# EAGLE design 4_serial_LSA (EAGLE 9.2.0)
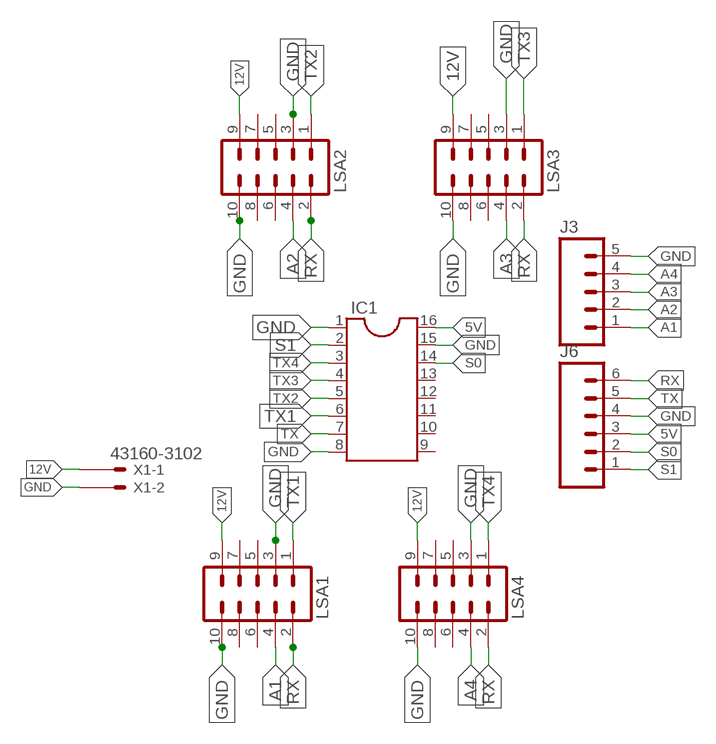
[diagram p0: schematic, sheet 1]

## Parts
IC1  DIL16S  [SOCKET-16]
J3  M05PTH  [1X05]
J6  M06SILK_FEMALE_PTH  [1X06]
LSA1  M05X2SHD_LOCK  [2X5-SHROUDED_LOCK]
LSA2  M05X2SHD_LOCK  [2X5-SHROUDED_LOCK]
LSA3  M05X2SHD_LOCK  [2X5-SHROUDED_LOCK]
LSA4  M05X2SHD_LOCK  [2X5-SHROUDED_LOCK]
X1  43160-3102  [43160-XX02]

## Nets
5V: IC1.16 J6.3
12V: LSA1.9 LSA2.9 LSA3.9 LSA4.9 X1.1@1(-1:S)
A1: J3.1 LSA1.4
A2: J3.2 LSA2.4
A3: J3.3 LSA3.4
A4: J3.4 LSA4.4
GND: IC1.1 IC1.8 IC1.15 J3.5 J6.4 LSA1.3 LSA1.10 LSA2.3 LSA2.10 LSA3.3 LSA3.10 LSA4.3 LSA4.10 X1.2@1(-2:S)
RX: J6.6 LSA1.2 LSA2.2 LSA3.2 LSA4.2
S0: IC1.14 J6.2
S1: IC1.2 J6.1
TX: IC1.7 J6.5
TX1: IC1.6 LSA1.1
TX2: IC1.5 LSA2.1
TX3: IC1.4 LSA3.1
TX4: IC1.3 LSA4.1
Unconnected: IC1.9 IC1.10 IC1.11 IC1.12 IC1.13 LSA1.5 LSA1.6 LSA1.7 LSA1.8 LSA2.5 LSA2.6 LSA2.7 LSA2.8 LSA3.5 LSA3.6 LSA3.7 LSA3.8 LSA4.5 LSA4.6 LSA4.7 LSA4.8 X1.1@2(-1:S) X1.2@2(-2:S)

## Library data of the parts
IC1 = ic-package:DIL16: Dual In Line / Socket
J3 = SparkFun-Connectors:M05: Header 5 Standard 5-pin 0.1" header. Use with straight break away headers (SKU : PRT-00116), right angle break away headers (PRT-00553), swiss pins (PRT-00743), machine pins (PRT-00117), and female headers (PRT-00115). Molex polarized connector foot print use with SKU : PRT-08230 with associated crimp pins and housings.; SPICEPREFIX: X
J6 = SparkFun-Connectors:M06: Header 6 Standard 6-pin 0.1" header. Use with straight break away headers (SKU : PRT-00116), right angle break away headers (PRT-00553), swiss pins (PRT-00743), machine pins (PRT-00117), and female headers (PRT-00115). Molex polarized connector foot print use with SKU : PRT-08094 with associated crimp pins and housings. NOTES ON THE VARIANTS LOCK and LOCK_LONGPADS... This footprint was designed to help hold the alignment of a through-hole component (i.e. 6-pin header) while soldering it into place. You may notice that each hole has been shifted either up or down by 0.005 of an inch from it's more standard position (which is a perfectly straight line). This slight alteration caused the pins (the squares in the middle) to touch the edges of the holes. Because they are alternating, it causes a "brace" to hold the component in place. 0.005 has proven to be the perfect amount of "off-center" position when using our standard breakaway headers. Although looks a little odd when you look at the bare footprint, once you have a header in there, the alteration is very hard to notice. Also,if you push a header all the way into place, it is covered up entirely on the bottom side. This idea of altering the position of holes to aid alignment will be further integrated into the Sparkfun Library for other footprints. It can help hold any component with 3 or more connection pins.; PROD_ID: CONN-08437
LSA1-LSA4 = SparkFun-Connectors:M05X2: Header 5x2 Standard 10-pin dual row 0.1" header. Commonly used with AVR-ISP. Use with Spark Fun Electronics SKU: PRT-00778
X1 = con-molex:43160-*02: SDA-43160 Connector Source: http://www.molex.com/pdm_docs/sd/431601306_sd.pdf; MF: WALDOM/MOLEX; MPN: 43160-3102; OC_FARNELL: 3293038; OC_NEWARK: 54H0264

## Net classes
0 default: width 0.305 mm, drill 0.508 mm, clearance 0.305 mm

## Board
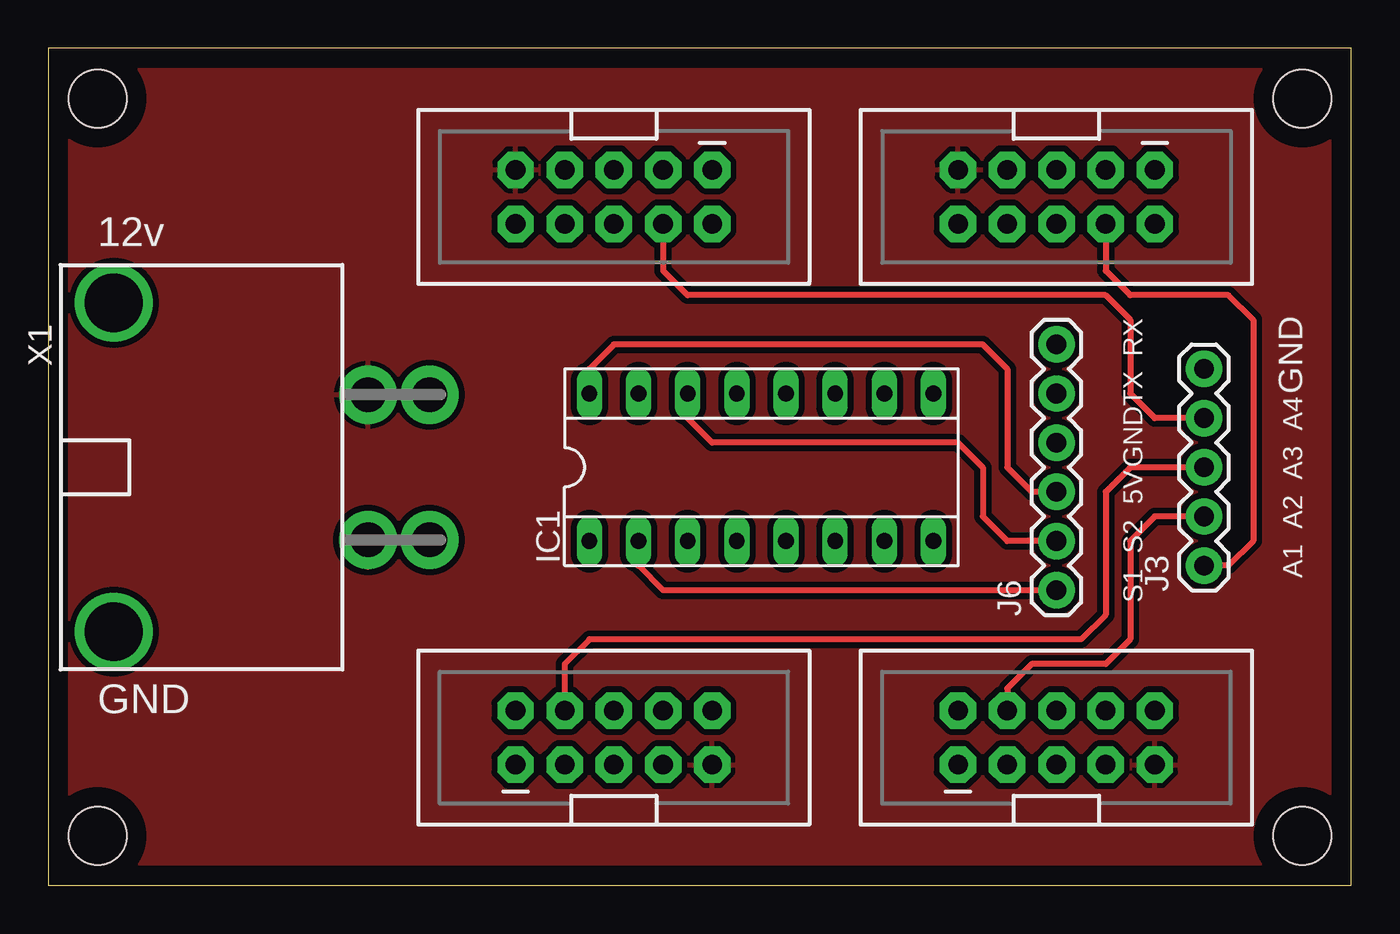
[diagram p1: board, top side]
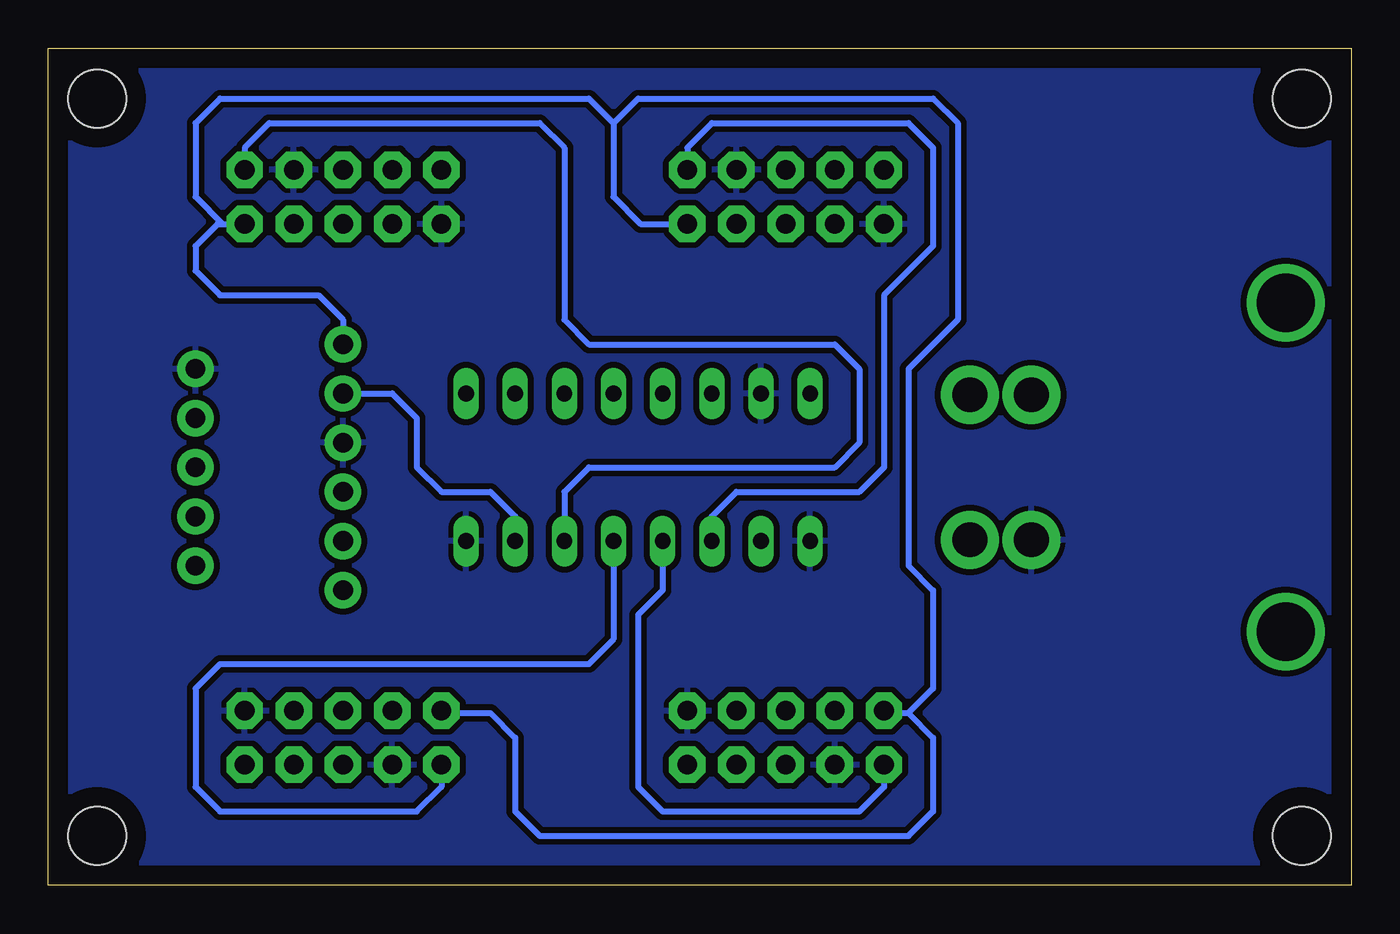
[diagram p2: board, bottom side, seen from below]

Size 67.29 x 43.23 mm. Coordinates in mm from the lower left corner, seen from the top.
Outline: 0,0 67.29,0 67.29,43.23 0,43.23 0,0
Copper layers (1*16): Top 0.035mm / dielectric 1.5mm / Bottom 0.035mm
Design rules "default": minimum track width 6mil, minimum drill 0.35mm, track to track 6mil, track to pad 6mil, pad to pad 6mil, via to via 6mil, smd to smd 6mil, copper to edge 40mil, drill to drill 6mil, minimum pad ring 10mil, minimum via ring 8mil, stop-mask expansion 4mil, vias tented up to drill 0mil, thermal gap 10mil
Holes 3 mm at 2.54,40.64 2.54,2.54 64.77,2.54 64.77,40.64

### Footprints (pad centres in the part's own frame; a part is rotated, then mirrored left to right if it is on the bottom)
SOCKET-16 = drill 0.813 long: 1 -8.89,-3.81; 2 -6.35,-3.81; 3 -3.81,-3.81; 4 -1.27,-3.81; 5 1.27,-3.81; 6 3.81,-3.81; 7 6.35,-3.81; 8 8.89,-3.81; 9 8.89,3.81; 10 6.35,3.81; 11 3.81,3.81; 12 1.27,3.81; 13 -1.27,3.81; 14 -3.81,3.81; 15 -6.35,3.81; 16 -8.89,3.81
1X05 = drill 1.016 pad 1.88: 1 0,0; 2 2.54,0; 3 5.08,0; 4 7.62,0; 5 10.16,0
1X06 = drill 1.016 pad 1.88: 1 0,0; 2 2.54,0; 3 5.08,0; 4 7.62,0; 5 10.16,0; 6 12.7,0
2X5-SHROUDED_LOCK = drill 1.016 pad 1.88 octagon: 1 -1.397,5.08; 2 1.397,5.08; 3 -1.397,2.54; 4 1.397,2.54; 5 -1.397,0; 6 1.397,0; 7 -1.397,-2.54; 8 1.397,-2.54; 9 -1.397,-5.08; 10 1.397,-5.08
43160-XX02 = drill 1.8 pad 3: 1@1 -3.745,0; 1@2 -3.745,3.18; 2@1 3.745,0; 2@2 3.745,3.18 | drill 3 pad 3.4: M1 -8.495,-13.13; M2 8.495,-13.13

### Placement (x,y rotation side)
IC1  36.83,21.59 0 top
J3  59.69,16.51 90 top
J6  52.07,15.24 90 top
LSA1  52.07,35.56 270 top
LSA2  52.07,7.62 90 top
LSA3  29.21,7.62 90 top
LSA4  29.21,35.56 270 top
X1  16.51,21.59 270 top

### Tracks (layer width: path | path; a pad name or v marks a point on that pad's centre or on a via)
5V
  Top 0.305: J6.3 50.8,20.32 49.53,21.59 49.53,26.67 48.26,27.94 29.21,27.94 27.94,26.67 IC1.16
12V
  pour Top (isolate 0.305): -1.27,44.45 -1.27,-1.27 68.58,-1.27 68.58,44.45
A1
  Top 0.305: J3.1 60.96,16.51 62.23,17.78 62.23,29.21 60.96,30.48 55.88,30.48 54.61,31.75 LSA1.4
A2
  Top 0.305: J3.2 57.15,19.05 55.88,17.78 55.88,12.7 54.61,11.43 50.8,11.43 49.53,10.16 LSA2.4
A3
  Top 0.305: J3.3 55.88,21.59 54.61,20.32 54.61,13.97 53.34,12.7 27.94,12.7 26.67,11.43 LSA3.4
A4
  Top 0.305: LSA4.4 31.75,31.75 33.02,30.48 54.61,30.48 55.88,29.21 55.88,25.4 57.15,24.13 J3.4
GND
  Top 0.406: 16.51,16.51 X1.2@1
  pour Bottom (isolate 0.305): -1.27,44.45 -1.27,-1.27 68.58,-1.27 68.58,44.45
RX
  Bottom 0.305: LSA4.2 36.7,34.16 38.1,35.56 38.1,39.37 | 38.1,39.37 39.37,40.64 58.42,40.64 59.69,39.37 59.69,35.56 58.29,34.16 | 58.29,34.16 LSA1.2 | LSA2.2 46.86,8.89 44.45,8.89 43.18,7.62 43.18,3.81 41.91,2.54 22.86,2.54 21.59,3.81 21.59,7.62 22.86,8.89 | 22.86,8.89 24,8.89 LSA3.2 | 58.29,34.16 58.55,34.16 59.69,33.02 59.69,31.75 58.42,30.48 53.34,30.48 52.07,29.21 J6.6 | 38.1,39.37 36.83,40.64 21.59,40.64 20.32,39.37 20.32,29.21 22.86,26.67 22.86,16.51 21.59,15.24 21.59,10.16 22.86,8.89
S0
  Top 0.305: J6.2 49.53,17.78 48.26,19.05 48.26,21.59 46.99,22.86 34.29,22.86 33.02,24.13 IC1.14
S1
  Top 0.305: J6.1 31.75,15.24 30.48,16.51 IC1.2
TX
  Bottom 0.305: IC1.7 43.18,19.05 44.45,20.32 46.99,20.32 48.26,21.59 48.26,24.13 49.53,25.4 J6.5
TX1
  Bottom 0.305: LSA1.1 57.15,38.1 55.88,39.37 41.91,39.37 40.64,38.1 40.64,29.21 39.37,27.94 26.67,27.94 25.4,26.67 25.4,22.86 26.67,21.59 39.37,21.59 40.64,20.32 IC1.6
TX2
  Bottom 0.305: 46.86,6.35 LSA2.1 46.99,5.08 48.26,3.81 58.42,3.81 59.69,5.08 59.69,10.16 58.42,11.43 39.37,11.43 38.1,12.7 IC1.5
TX3
  Bottom 0.305: LSA3.1 24.13,5.08 25.4,3.81 35.56,3.81 36.83,5.08 36.83,13.97 35.56,15.24 IC1.4
TX4
  Bottom 0.305: LSA4.1 34.29,38.1 33.02,39.37 22.86,39.37 21.59,38.1 21.59,33.02 24.13,30.48 24.13,21.59 25.4,20.32 31.75,20.32 33.02,19.05 IC1.3

### Text on the board
tNames: 12v | RX | GND | TX | A4 | GND | A3 | 5V | A2 | S2 | A1 | S1 | GND